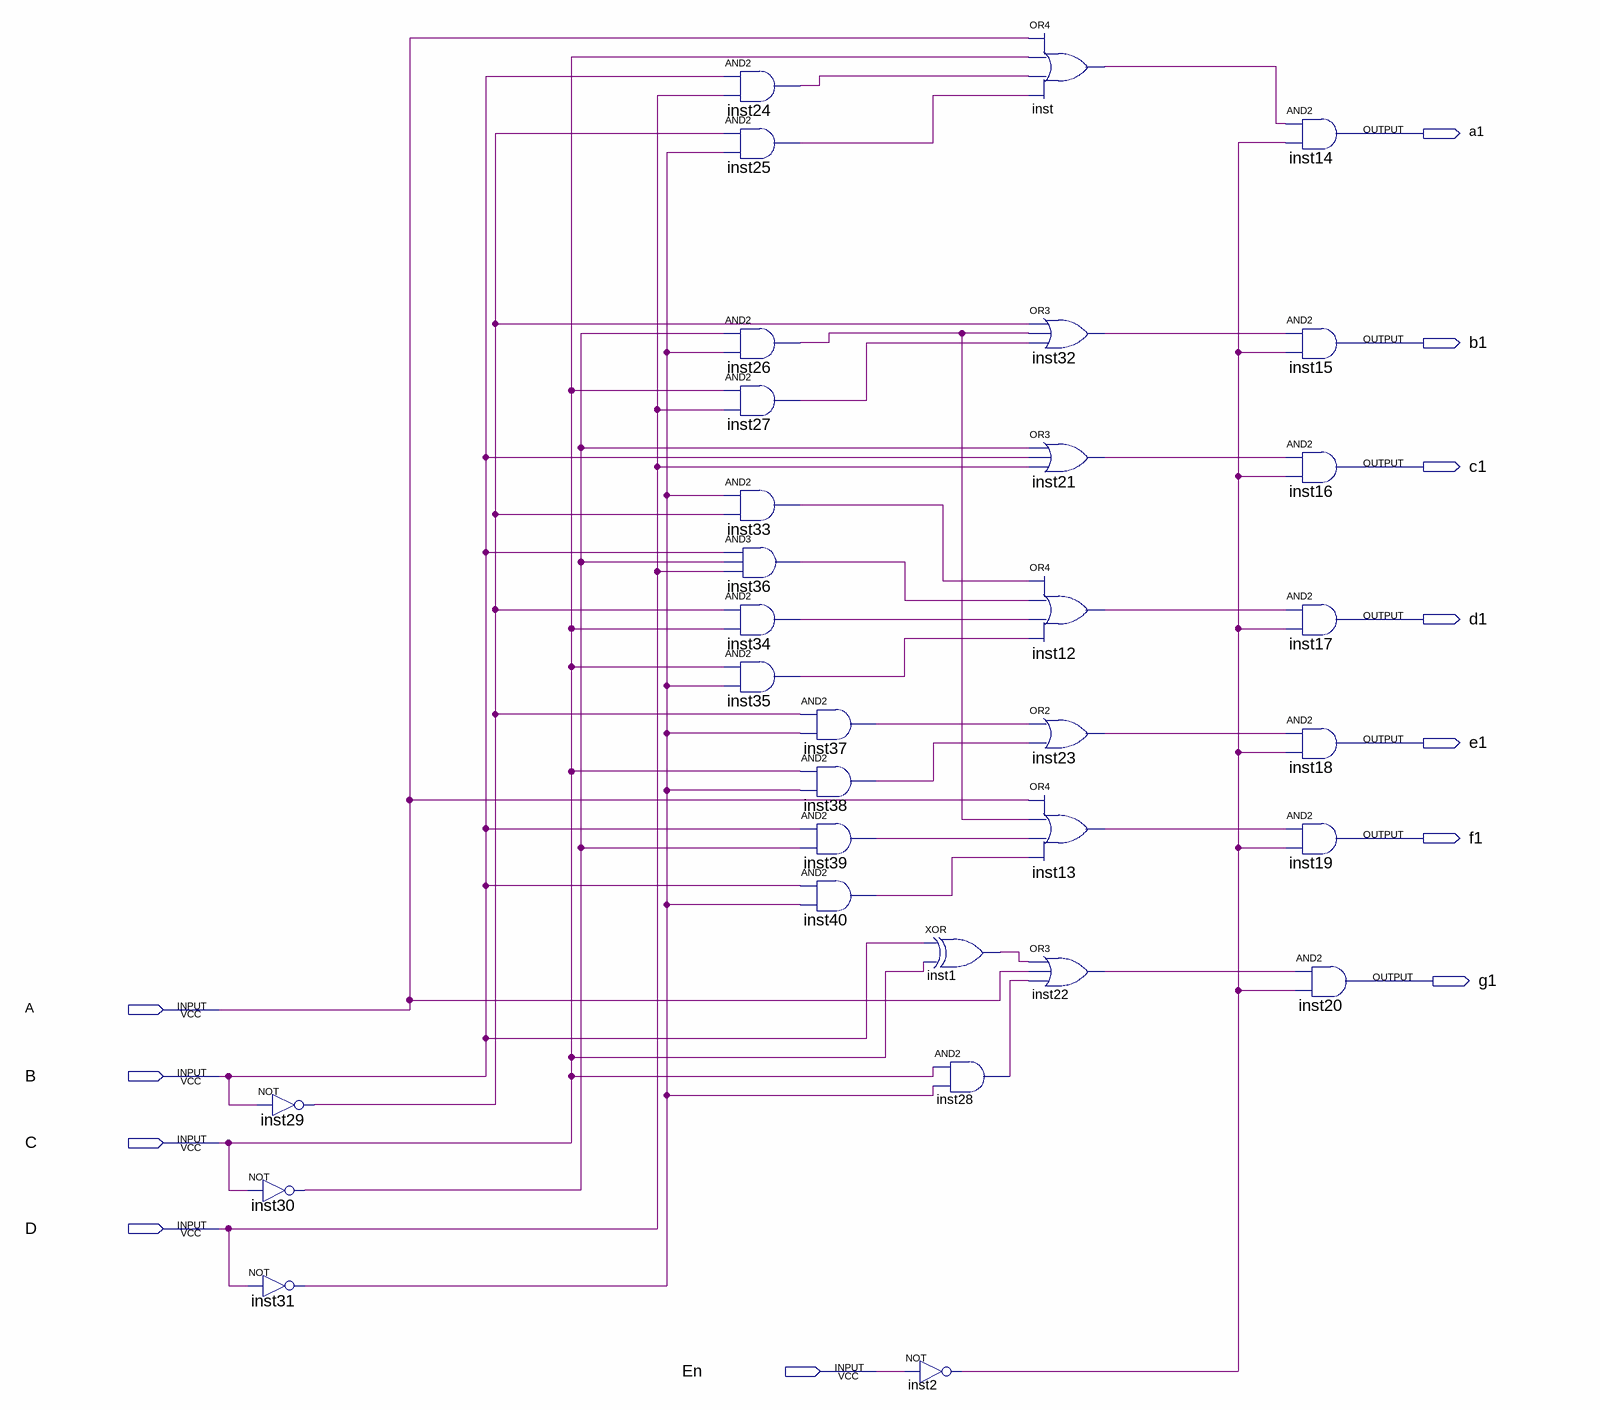
[diagram p0: schematic sheet]
// Quartus schematic bcdTo7seg.bdf as structural Verilog: 32 symbols, 12 pins
module bcdTo7seg (
  input  A,
  input  B,
  input  C,
  input  D,
  input  En,
  output a1,
  output b1,
  output c1,
  output d1,
  output e1,
  output f1,
  output g1
);

  wire inst1_out, inst2_out, inst12_out, inst13_out, inst21_out, inst22_out, inst23_out, inst24_out,
       inst25_out, inst26_out, inst27_out, inst28_out, inst29_out, inst30_out, inst31_out, inst32_out,
       inst33_out, inst34_out, inst35_out, inst36_out, inst37_out, inst38_out, inst39_out, inst40_out,
       inst_out;

  not inst29 (inst29_out, B);
  not inst30 (inst30_out, C);
  not inst31 (inst31_out, D);
  and inst24 (inst24_out, B, D);
  and inst25 (inst25_out, inst29_out, inst31_out);
  and inst26 (inst26_out, inst30_out, inst31_out);
  and inst27 (inst27_out, C, D);
  and inst33 (inst33_out, inst31_out, inst29_out);
  and inst36 (inst36_out, B, inst30_out, D);
  and inst34 (inst34_out, inst29_out, C);
  and inst35 (inst35_out, C, inst31_out);
  and inst37 (inst37_out, inst29_out, inst31_out);
  and inst38 (inst38_out, C, inst31_out);
  and inst39 (inst39_out, B, inst30_out);
  and inst40 (inst40_out, B, inst31_out);
  xor inst1 (inst1_out, B, C);
  and inst28 (inst28_out, C, inst31_out);
  not inst2 (inst2_out, En);
  or inst (inst_out, A, C, inst24_out, inst25_out);
  or inst32 (inst32_out, inst29_out, inst26_out, inst27_out);
  or inst21 (inst21_out, inst30_out, B, D);
  or inst12 (inst12_out, inst33_out, inst36_out, inst34_out, inst35_out);
  or inst23 (inst23_out, inst37_out, inst38_out);
  or inst13 (inst13_out, A, inst26_out, inst39_out, inst40_out);
  or inst22 (inst22_out, inst1_out, A, inst28_out);
  and inst14 (a1, inst_out, inst2_out);
  and inst15 (b1, inst32_out, inst2_out);
  and inst16 (c1, inst21_out, inst2_out);
  and inst17 (d1, inst12_out, inst2_out);
  and inst18 (e1, inst23_out, inst2_out);
  and inst19 (f1, inst13_out, inst2_out);
  and inst20 (g1, inst22_out, inst2_out);
endmodule
